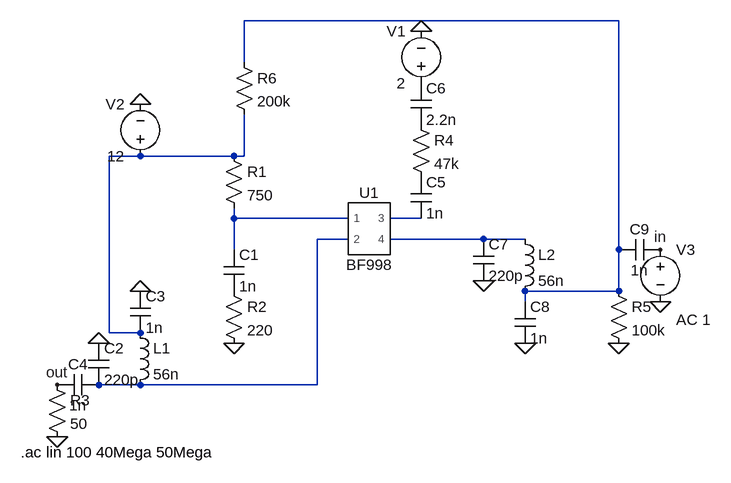
[diagram p0: schematic 45MegaLNA.asc]
45MegaLNA.asc, the LTspice schematic file:
Version 4.1
SHEET 1 1440 712
WIRE 1296 32 720 32
WIRE 720 96 720 32
WIRE 560 240 512 240
WIRE 704 240 560 240
WIRE 720 240 720 176
WIRE 720 240 704 240
WIRE 704 336 704 320
WIRE 880 336 704 336
WIRE 992 336 944 336
WIRE 880 368 832 368
WIRE 1088 368 944 368
WIRE 1152 368 1088 368
WIRE 704 384 704 336
WIRE 1296 384 1296 32
WIRE 1296 448 1296 384
WIRE 1296 448 1152 448
WIRE 1152 464 1152 448
WIRE 512 512 512 240
WIRE 560 512 512 512
WIRE 560 592 496 592
WIRE 832 592 832 368
WIRE 832 592 560 592
FLAG 704 528 0
FLAG 496 528 0
FLAG 560 448 0
FLAG 432 672 0
FLAG 992 48 0
FLAG 1088 432 0
FLAG 1152 528 0
FLAG 1296 528 0
FLAG 560 160 0
FLAG 432 592 out
FLAG 1360 464 0
FLAG 1360 384 in
SYMBOL BF998 912 352 R0
SYMATTR InstName U1
SYMBOL res 688 224 R0
SYMATTR InstName R1
SYMATTR Value 750
SYMBOL cap 688 384 R0
SYMATTR InstName C1
SYMATTR Value 1n
SYMBOL res 688 432 R0
SYMATTR InstName R2
SYMATTR Value 220
SYMBOL cap 480 528 R0
SYMATTR InstName C2
SYMATTR Value 220p
SYMBOL ind 544 496 R0
SYMATTR InstName L1
SYMATTR Value 56n
SYMATTR SpiceLine Rser=1m
SYMBOL cap 544 448 R0
SYMATTR InstName C3
SYMATTR Value 1n
SYMBOL cap 496 576 R90
WINDOW 0 0 32 VBottom 2
WINDOW 3 32 32 VTop 2
SYMATTR InstName C4
SYMATTR Value 1n
SYMBOL res 416 576 R0
SYMATTR InstName R3
SYMATTR Value 50
SYMBOL cap 976 272 R0
SYMATTR InstName C5
SYMATTR Value 1n
SYMBOL res 976 176 R0
SYMATTR InstName R4
SYMATTR Value 47k
SYMBOL cap 976 128 R0
SYMATTR InstName C6
SYMATTR Value 2.2n
SYMBOL voltage 992 144 R180
WINDOW 0 24 96 Left 2
WINDOW 3 24 16 Left 2
SYMATTR InstName V1
SYMATTR Value 2
SYMBOL cap 1072 368 R0
SYMATTR InstName C7
SYMATTR Value 220p
SYMBOL ind 1136 352 R0
SYMATTR InstName L2
SYMATTR Value 56n
SYMATTR SpiceLine Rser=1m
SYMBOL cap 1136 464 R0
SYMATTR InstName C8
SYMATTR Value 1n
SYMBOL res 1280 432 R0
SYMATTR InstName R5
SYMATTR Value 100k
SYMBOL res 704 80 R0
SYMATTR InstName R6
SYMATTR Value 200k
SYMBOL voltage 560 256 R180
WINDOW 0 24 96 Left 2
WINDOW 3 24 16 Left 2
SYMATTR InstName V2
SYMATTR Value 12
SYMBOL cap 1360 368 R90
WINDOW 0 0 32 VBottom 2
WINDOW 3 32 32 VTop 2
SYMATTR InstName C9
SYMATTR Value 1n
SYMBOL voltage 1360 368 R0
WINDOW 123 24 124 Left 2
WINDOW 39 0 0 Left 0
SYMATTR InstName V3
SYMATTR Value ""
SYMATTR Value2 AC 1
TEXT 376 696 Left 2 !.ac lin 100 40Mega 50Mega

The netlist it stands for:
* 45MegaLNA.asc
X§U1 N003 N005 N004 N006 BF998  ; pins 1 2 3 4
R1 N002 N003 750
C1 N003 P001 1n
R2 P001 0 220
C2 0 N005 220p
L1 N002 N005 56n Rser=1m
C3 0 N002 1n
C4 N005 out 1n
R3 out 0 50
C5 P002 N004 1n
R4 P003 P002 47k
C6 P004 P003 2.2n
V1 P004 0 2
C7 N006 0 220p
L2 N006 N001 56n Rser=1m
C8 N001 0 1n
R5 N001 0 100k
R6 N001 N002 200k
V2 N002 0 12
C9 in N001 1n
V3 in 0 AC 1
.ac lin 100 40Mega 50Mega
.lib bf998.lib
.backanno
.end